# Altium project stimu.PrjPcb
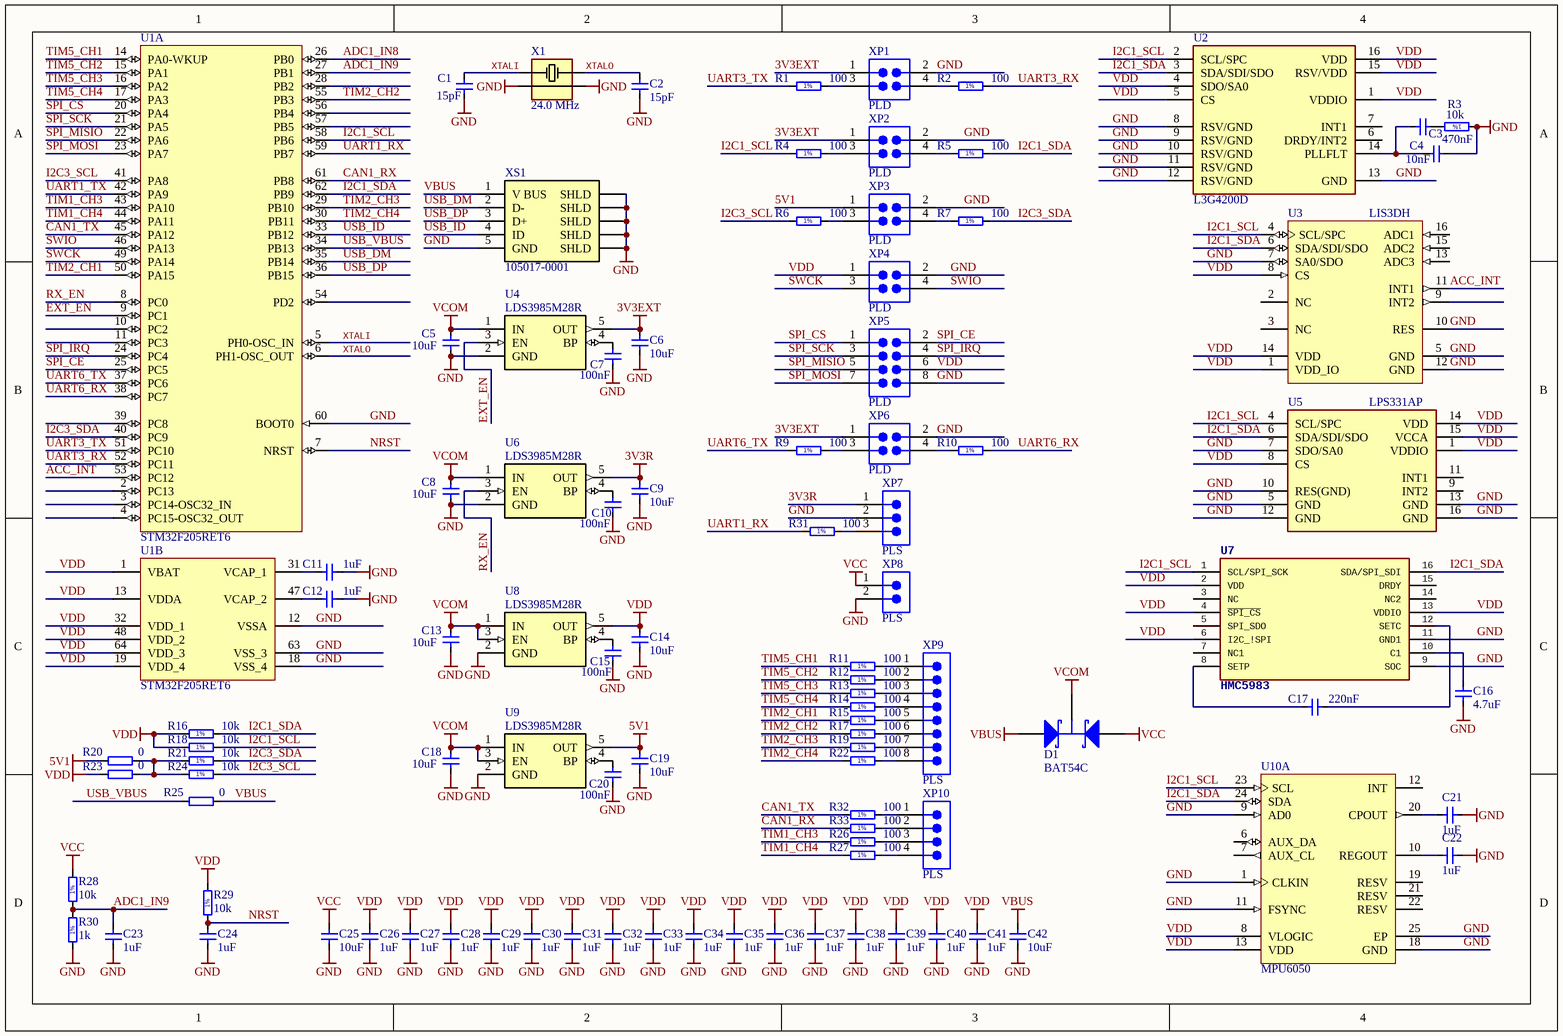
[diagram p0: stimu.SchDoc]
1 sheet, 98 parts. Net scope: global (net labels, ports and power ports of the same name join across sheets).
Board file: stimu.PcbDoc

## Sheet stimu.SchDoc
size A4

### Parts
(Parts that share a designator on the sheet are numbered #1, #2 ... from top to bottom, then left to right.)
C1  15pF  [CAP0402R]
C2  15pF  [CAP0402R]
C3  470nF  [CAP0402R]
C4  10nF  [CAP0402R]
C5  10uF  [CAP0603R]
C6  10uF  [CAP0603R]
C7  100nF  [CAP0402R]
C8  10uF  [CAP0603R]
C9  10uF  [CAP0603R]
C10  100nF  [CAP0402R]
C11  1uF  [CAP0402R]
C12  1uF  [CAP0402R]
C13  10uF  [CAP0603R]
C14  10uF  [CAP0603R]
C15  100nF  [CAP0402R]
C16  4.7uF  [CAP0402R]
C17  220nF  [CAP0402R]
C18  10uF  [CAP0603R]
C19  10uF  [CAP0603R]
C20  100nF  [CAP0402R]
C21  1uF  [CAP0402R]
C22  1uF  [CAP0402R]
C23  1uF  [CAP0402R]
C24  1uF  [CAP0402R]
C25  10uF  [CAP0805R]
C26  1uF  [CAP0402R]
C27  1uF  [CAP0402R]
C28  1uF  [CAP0402R]
C29  1uF  [CAP0402R]
C30  1uF  [CAP0402R]
C31  1uF  [CAP0402R]
C32  1uF  [CAP0402R]
C33  1uF  [CAP0402R]
C34  1uF  [CAP0402R]
C35  1uF  [CAP0402R]
C36  1uF  [CAP0402R]
C37  1uF  [CAP0402R]
C38  1uF  [CAP0402R]
C39  1uF  [CAP0402R]
C40  1uF  [CAP0402R]
C41  1uF  [CAP0402R]
C42  10uF  [CAP0603R]
D1  BAT54C  [NXP-SOT23-3_V]
R1  100  [RES0402R]
R2  100  [RES0402R]
R3  10k  [RES0402R]
R4  100  [RES0402R]
R5  100  [RES0402R]
R6  100  [RES0402R]
R7  100  [RES0402R]
R9  100  [RES0402R]
R10  100  [RES0402R]
R11  100  [RES0402R]
R12  100  [RES0402R]
R13  100  [RES0402R]
R14  100  [RES0402R]
R15  100  [RES0402R]
R16  10k  [RES0402R]
R17  100  [RES0402R]
R18  10k  [RES0402R]
R19  100  [RES0402R]
R20  0  [RES0402R]
R21  10k  [RES0402R]
R22  100  [RES0402R]
R23  0  [RES0402R]
R24  10k  [RES0402R]
R25  0  [RES0402R]
R26  100  [RES0402R]
R27  100  [RES0402R]
R28  10k  [RES0402R]
R29  10k  [RES0402R]
R30  1k  [RES0402R]
R31  100  [RES0402R]
R32  100  [RES0402R]
R33  100  [RES0402R]
U1#1  STM32F205RET6  [LQFP64_L]  (part A of 2)
U1#2  STM32F205RET6  [LQFP64_L]  (part B of 2)
U2  L3G4200D  [LGA16-4X4X1.1_L]
U3  LIS3DH  [STM-LGA-16_N]
U4  LDS3985M28R  [SOT23H15-5]
U5  LPS331AP  [HCLGA-16L]
U6  LDS3985M28R  [SOT23H15-5]
U7  HMC5983  [HMC5983]
U8  LDS3985M28R  [SOT23H15-5]
U9  LDS3985M28R  [SOT23H15-5]
U10  MPU6050  [INSE-QFN-24_V]  (part A of 2)
X1  24.0 MHz  [3225]
XP1  PLD  [PLD-04]
XP2  PLD  [PLD-04]
XP3  PLD  [PLD-04]
XP4  PLD  [PLD-04]
XP5  PLD  [PLD-08]
XP6  PLD  [PLD-04]
XP7  PLS  [PLS-03]
XP8  PLS  [PLS-02]
XP9  PLS  [PLS-08]
XP10  PLS  [PLS-04]
XS1  105017-0001  [105017-0001]

### Nets
3V3EXT: C6.2 U4.5(OUT) XP1.1 XP2.1 XP6.1
3V3R: C9.2 U6.5(OUT) XP7.1
5V1: C19.2 R20.1 U9.5(OUT) XP3.1
GND: C1.2 C2.2 C4.1 C5.1 C6.1 C7.2 C8.1 C9.1 C10.2 C11.1 C12.1 C13.1 C14.1 C15.2 C16.2 C18.1 C19.1 C20.2 C21.2 C22.2 C23.1 C24.1 C25.1 C26.2 C27.2 C28.2 C29.2 C30.2 C31.2 C32.2 C33.2 C34.2 C35.2 C36.2 C37.2 C38.2 C39.2 C40.2 C41.2 C42.1 R3.1 R30.1 U1#1.60(BOOT0) U1#2.12(VSSA) U1#2.18(VSS_4) U1#2.63(VSS_3) U2.8(RSV/GND) U2.9(RSV/GND) U2.10(RSV/GND) U2.11(RSV/GND) U2.12(RSV/GND) U2.13(GND) U3.5(GND) U3.7(SA0/SDO) U3.10(RES) U3.12(GND) U4.2(GND) U5.5(GND) U5.7(SDO/SA0) U5.10(RES(GND)) U5.12(GND) U5.13(GND) U5.16(GND) U6.2(GND) U7.9(SOC) U7.11(GND1) U8.2(GND) U9.2(GND) U10.1(CLKIN) U10.9(AD0) U10.11(FSYNC) U10.18(GND) U10.25(EP) X1.2 X1.4 XP1.2 XP2.2 XP3.2 XP4.2 XP5.8 XP6.2 XP7.2 XP8.2 XS1.5(GND) XS1.SHLD
VBUS: C42.2 D1.1(A) R25.2 XS1.1(V_BUS)
VCC: C25.2 D1.2(A) R28.2 XP8.1
VCOM: C5.2 C8.2 C13.2 C18.2 D1.3(K) U4.1(IN) U6.1(IN) U8.1(IN) U8.3(EN) U9.1(IN) U9.3(EN)
VDD: C14.2 C26.1 C27.1 C28.1 C29.1 C30.1 C31.1 C32.1 C33.1 C34.1 C35.1 C36.1 C37.1 C38.1 C39.1 C40.1 C41.1 R16.1 R18.1 R23.1 R29.2 U1#2.1(VBAT) U1#2.13(VDDA) U1#2.19(VDD_4) U1#2.32(VDD_1) U1#2.48(VDD_2) U1#2.64(VDD_3) U2.1(VDDIO) U2.4(SDO/SA0) U2.5(CS) U2.15(RSV/VDD) U2.16(VDD) U3.1(VDD_IO) U3.8(CS) U3.14(VDD) U5.1(VDDIO) U5.8(CS) U5.14(VDD) U5.15(VCCA) U7.2(VDD) U7.4(~{SPI_CS}) U7.6(I2C_!SPI) U7.13(VDDIO) U8.5(OUT) U10.8(VLOGIC) U10.13(VDD) XP4.1 XP5.6
ACC_INT: U1#1.53(PC12) U3.11(INT1)
ADC1_IN8: U1#1.26(PB0)
ADC1_IN9: C23.2 R28.1 R30.2 U1#1.27(PB1)
CAN1_RX: R33.1 U1#1.61(PB8)
CAN1_TX: R32.1 U1#1.45(PA12)
EXT_EN: U1#1.9(PC1) U4.3(EN)
I2C1_SCL: R4.1 R18.2 U1#1.58(PB6) U2.2(SCL/SPC) U3.4(SCL/SPC) U5.4(SCL/SPC) U7.1(SCL/SPI_SCK) U10.23(SCL)
I2C1_SDA: R5.2 R16.2 U1#1.62(PB9) U2.3(SDA/SDI/SDO) U3.6(SDA/SDI/SDO) U5.6(SDA/SDI/SDO) U7.16(SDA/SPI_SDI) U10.24(SDA)
I2C3_SCL: R6.1 R24.2 U1#1.41(PA8)
I2C3_SDA: R7.2 R21.2 U1#1.40(PC9)
NRST: C24.2 R29.1 U1#1.7(NRST)
RX_EN: U1#1.8(PC0) U6.3(EN)
SPI_CE: U1#1.25(PC5) XP5.2
SPI_CS: U1#1.20(PA4) XP5.1
SPI_IRQ: U1#1.24(PC4) XP5.4
SPI_MISIO: U1#1.22(PA6) XP5.5
SPI_MOSI: U1#1.23(PA7) XP5.7
SPI_SCK: U1#1.21(PA5) XP5.3
SWCK: U1#1.49(PA14) XP4.3
SWIO: U1#1.46(PA13) XP4.4
TIM1_CH3: R26.1 U1#1.43(PA10)
TIM1_CH4: R27.1 U1#1.44(PA11)
TIM2_CH1: R15.1 U1#1.50(PA15)
TIM2_CH2: R17.1 U1#1.55(PB3)
TIM2_CH3: R19.1 U1#1.29(PB10)
TIM2_CH4: R22.1 U1#1.30(PB11)
TIM5_CH1: R11.1 U1#1.14(PA0-WKUP)
TIM5_CH2: R12.1 U1#1.15(PA1)
TIM5_CH3: R13.1 U1#1.16(PA2)
TIM5_CH4: R14.1 U1#1.17(PA3)
UART1_RX: R31.1 U1#1.59(PB7)
UART1_TX: U1#1.42(PA9)
UART3_RX: R2.2 U1#1.52(PC11)
UART3_TX: R1.1 U1#1.51(PC10)
UART6_RX: R10.2 U1#1.38(PC7)
UART6_TX: R9.1 U1#1.37(PC6)
USB_DM: U1#1.35(PB14) XS1.2(D-)
USB_DP: U1#1.36(PB15) XS1.3(D+)
USB_ID: U1#1.33(PB12) XS1.4(ID)
USB_VBUS: R25.1 U1#1.34(PB13)
XTALI: C1.1 U1#1.5(PH0-OSC_IN) X1.1
XTALO: C2.1 U1#1.6(PH1-OSC_OUT) X1.3
NetC3_1: C3.1 R3.2
NetC3_2: C3.2 C4.2 U2.14(PLLFLT)
NetC7_1: C7.1 U4.4(BP)
NetC10_1: C10.1 U6.4(BP)
NetC11_2: C11.2 U1#2.31(VCAP_1)
NetC12_2: C12.2 U1#2.47(VCAP_2)
NetC15_1: C15.1 U8.4(BP)
NetC16_1: C16.1 U7.10(C1)
NetC17_1: C17.1 U7.12(SETC)
NetC17_2: C17.2 U7.8(SETP)
NetC20_1: C20.1 U9.4(BP)
NetC21_1: C21.1 U10.20(CPOUT)
NetC22_1: C22.1 U10.10(REGOUT)
NetR1_2: R1.2 XP1.3
NetR2_1: R2.1 XP1.4
NetR4_2: R4.2 XP2.3
NetR5_1: R5.1 XP2.4
NetR6_2: R6.2 XP3.3
NetR7_1: R7.1 XP3.4
NetR9_2: R9.2 XP6.3
NetR10_1: R10.1 XP6.4
NetR11_2: R11.2 XP9.1
NetR12_2: R12.2 XP9.2
NetR13_2: R13.2 XP9.3
NetR14_2: R14.2 XP9.4
NetR15_2: R15.2 XP9.5
NetR17_2: R17.2 XP9.6
NetR19_2: R19.2 XP9.7
NetR20_2: R20.2 R21.1 R23.2 R24.1
NetR22_2: R22.2 XP9.8
NetR26_2: R26.2 XP10.3
NetR27_2: R27.2 XP10.4
NetR31_2: R31.2 XP7.3
NetR32_2: R32.2 XP10.1
NetR33_2: R33.2 XP10.2

Not connected (* = marked no-connect by the designer): U1#1 2(PC13) 3(PC14-OSC32_IN) 4(PC15-OSC32_OUT) 10(PC2) 11(PC3) 28(PB2) 39(PC8) 54(PD2) 56(PB4) 57(PB5); U2 6(DRDY/INT2) 7(INT1); U3 2(NC) 3(NC) 9(INT2) 13(ADC3) 15(ADC2) 16(ADC1); U5 9(INT2) 11(INT1); U7 3(NC) 5(SPI_SDO) 7(NC1) 14(NC2) 15(DRDY); U10 6(AUX_DA) 7(AUX_CL) 12(INT) 19(RESV) 21(RESV) 22(RESV)

### Notes on the sheet
- (in symbol R0402_1K_1%_0.0625W_100PPM) 1%
- (in symbol R0402_10K_1%_0.0625W_100PPM) 1%
- (in symbol R0402_100R_1%_0.0625W_100PPM) 1%

### Library data of the parts
C1 C2 = CC0402_15PF_50V_5%_NP0: Part Description: SMD Multilayer Chip Ceramic Capacitor; Manufacturer: GENERIC; Manufacturer1 Part Number: 223886915159; Voltage: 50V; TC: NP0; Tolerance: ±5%; Table: Capacitors SMD; Part Number: CC0402_15PF_50V_5%_NP0; Component Kind: Standard; Component Type: Standard; Pin Count: 2; Value: 15pF; Status: Not Recommended; Manufacturer Part Number: CC0402_15PF_50V_5%_NP0; Case: 0402; Mounted: Yes; Socket: No; SMD: Yes; Manufacturer1 Example: PHYCOMP; Manufacturer1 ComponentHeight: 0.55mm; HelpURL: \\cern.ch\dfs\Applications\Altium\Datasheets\CC0402_NP0_PHYCOMP.pdf; Author: I. Kuznetsov; CreateDate: 03.12.2007; LatestRevisionDate: 03.12.2007; Manufacturer Part Number 2: CC0402JPNPO9BN150
C3 = CC0402_470NF_6.3V_10%_X5R: Part Description: SMD Multilayer Chip Ceramic Capacitor; Manufacturer: GENERIC; Manufacturer1 Part Number: GRM155R60J474KE19D; Voltage: 6.3V; TC: X5R; Tolerance: ±10%; Table: Capacitors SMD; Part Number: CC0402_470NF_6.3V_10%_X5R; Component Kind: Standard; Component Type: Standard; Pin Count: 2; Value: 470nF; Status: Preferred; Manufacturer Part Number: CC0402_470NF_6.3V_10%_X5R; Case: 0402; Mounted: Yes; Socket: No; SMD: Yes; Manufacturer1 Example: MURATA; Manufacturer1 ComponentHeight: 0.55mm; HelpURL: \\cern.ch\dfs\Applications\Altium\Datasheets\CC0402_X5R_MURATA_GRM.pdf; Author: I. Kuznetsov; CreateDate: 22.04.2010; LatestRevisionDate: 22.04.2010
C4 = CC0402_10NF_25V_10%_X7R: Part Description: SMD Multilayer Chip Ceramic Capacitor; Manufacturer: GENERIC; Manufacturer1 Part Number: C1005X7R1E103KT; Voltage: 25V; TC: X7R; Tolerance: ±10%; Table: Capacitors SMD; Part Number: CC0402_10NF_25V_10%_X7R; Component Kind: Standard; Component Type: Standard; Pin Count: 2; Value: 10nF; Status: Preferred; Manufacturer Part Number: CC0402_10NF_25V_10%_X7R; Case: 0402; Mounted: Yes; Socket: No; SMD: Yes; Manufacturer1 Example: TDK; Manufacturer1 ComponentHeight: 0.55mm; HelpURL: \\cern.ch\dfs\Applications\Altium\Datasheets\CC0402_X7R_TDK_C.pdf; Author: I. Kuznetsov; CreateDate: 25.10.2012; LatestRevisionDate: 25.10.2012
C5 C6 C8 C9 C13 C14 C18 C19 C42 = CC0603_10UF_6.3V_20%_X5R: Part Description: SMD Multilayer Chip Ceramic Capacitor; Manufacturer: GENERIC; Manufacturer1 Part Number: C0603C106M9PAC; Voltage: 6.3V; TC: X5R; Tolerance: ±20%; Table: Capacitors SMD; Part Number: CC0603_10UF_6.3V_20%_X5R; Component Kind: Standard; Component Type: Standard; Pin Count: 2; Value: 10uF; Status: Preferred; Manufacturer Part Number: CC0603_10uF_6.3V_20%_X5R; Case: 0603; Mounted: Yes; Socket: No; SMD: Yes; Manufacturer1 Example: KEMET; Manufacturer1 ComponentHeight: 0.95mm; HelpURL: \\cern.ch\dfs\Applications\Altium\Datasheets\CC0603_X5R_KEMET.pdf; Author: I. Kuznetsov; CreateDate: 03.12.2007; LatestRevisionDate: 03.12.2007
C7 C10 C15 C20 = CC0402_100NF_16V_10%_X5R: Part Description: SMD Multilayer Chip Ceramic Capacitor; Manufacturer: GENERIC; Manufacturer1 Part Number: GRM155R61C104KA88D; Voltage: 16V; TC: X5R; Tolerance: ±10%; Table: Capacitors SMD; Part Number: CC0402_100NF_16V_10%_X5R; Component Kind: Standard; Component Type: Standard; Pin Count: 2; Value: 100nF; Status: None; Manufacturer Part Number: CC0402_100NF_16V_10%_X5R; Case: 0402; Mounted: Yes; Socket: No; SMD: Yes; Manufacturer1 Example: MURATA; Manufacturer1 ComponentHeight: 0.55mm; HelpURL: \\cern.ch\dfs\Applications\Altium\Datasheets\CC0402_X5R_MURATA_GRM.pdf; Author: I. Kuznetsov; CreateDate: 10.12.2013; LatestRevisionDate: 10.12.2013; Manufacturer Part Number 2: CC0402KPX5R7BB104
C11 C12 C21-C24 C26-C41 = CC0402_1UF_16V_10%_X5R: Part Description: SMD Multilayer Chip Ceramic Capacitor; Manufacturer: GENERIC; Manufacturer1 Part Number: C1005X5R1C105KT; Voltage: 16V; TC: X5R; Tolerance: ±10%; Table: Capacitors SMD; Part Number: CC0402_1UF_16V_10%_X5R; Component Kind: Standard; Component Type: Standard; Pin Count: 2; Value: 1uF; Status: Preferred; Manufacturer Part Number: CC0402_1UF_16V_10%_X5R; Case: 0402; Mounted: Yes; Socket: No; SMD: Yes; Manufacturer1 Example: TDK; Manufacturer1 ComponentHeight: 0.55mm; HelpURL: \\cern.ch\dfs\Applications\Altium\Datasheets\CC0402_X5R_TDK_C.pdf; Author: I. Kuznetsov; CreateDate: 25.10.2012; LatestRevisionDate: 25.10.2012
C16 = CC0402_4.7UF_4V_20%_X5R: Part Description: SMD Multilayer Chip Ceramic Capacitor; Manufacturer: GENERIC; Manufacturer1 Part Number: C0402C475M7PAC; Voltage: 4V; TC: X5R; Tolerance: ±20%; Table: Capacitors SMD; Part Number: CC0402_4.7UF_4V_20%_X5R; Component Kind: Standard; Component Type: Standard; Pin Count: 2; Value: 4.7uF; Status: Preferred; Manufacturer Part Number: CC0402_4.7UF_4V_20%_X5R; Case: 0402; Mounted: Yes; Socket: No; SMD: Yes; Manufacturer1 Example: KEMET; Manufacturer1 ComponentHeight: 0.55mm; HelpURL: \\cern.ch\dfs\Applications\Altium\Datasheets\CC0402_X5R_KEMET.pdf; Author: I. Kuznetsov; CreateDate: 08.06.2010; LatestRevisionDate: 08.06.2010; Manufacturer Part Number 2: CC0402MRX5R4BB475
C17 = CC0402_220NF_16V_10%_X7R: Part Description: SMD Multilayer Chip Ceramic Capacitor; Manufacturer: GENERIC; Manufacturer1 Part Number: C1005X7R1C224KT; Voltage: 16V; TC: X7R; Tolerance: ±10%; Table: Capacitors SMD; Part Number: CC0402_220NF_16V_10%_X7R; Component Kind: Standard; Component Type: Standard; Pin Count: 2; Value: 220nF; Status: Preferred; Manufacturer Part Number: CC0402_220NF_16V_10%_X7R; Case: 0402; Mounted: Yes; Socket: No; SMD: Yes; Manufacturer1 Example: TDK; Manufacturer1 ComponentHeight: 0.55mm; HelpURL: \\cern.ch\dfs\Applications\Altium\Datasheets\CC0402_X7R_TDK_C.pdf; Author: I. Kuznetsov; CreateDate: 25.10.2012; LatestRevisionDate: 25.10.2012; Manufacturer Part Number 2: CC0402KRX7R7BB224
C25 = CC0805_10UF_10V_10%_X7R: Part Description: SMD Multilayer Chip Ceramic Capacitor; Manufacturer: GENERIC; Manufacturer1 Part Number: GRM21BR71A106KE51L; Voltage: 10V; TC: X7R; Tolerance: ±10%; Table: Capacitors SMD; Part Number: CC0805_10UF_10V_10%_X7R; Component Kind: Standard; Component Type: Standard; Pin Count: 2; Value: 10uF; Status: Preferred; Manufacturer Part Number: CC0805_10UF_10V_10%_X7R; Case: 0805; Mounted: Yes; Socket: No; SMD: Yes; Manufacturer1 Example: MURATA; Manufacturer1 ComponentHeight: 1.35mm; HelpURL: \\cern.ch\dfs\Applications\Altium\Datasheets\CC0805_X7R_MURATA.pdf; Author: I. Kuznetsov; CreateDate: 30.04.2012; LatestRevisionDate: 30.04.2012; Manufacturer Part Number 2: CC0805KKX7R6BB106
D1 = CMP-0417-00003-1: Schottky Barrier Diode, 30 V, 2 uA, -55 to 150 degC, 3-Pin SOT23, RoHS, Tape and Reel; Manufacturer: NXP Semiconductors; IR (uA): 2; VF (mV): 800; Trr (ns): 5; Cd (pF): 10; VR (V): 30; Rth(j-a) (K/W): 500; RoHS: TRUE; Packing: Tape and Reel; ComponentLink2URL: http://www.nxp.com/documents/data_sheet/BAT54_SER.pdf; PartNumber: BAT54C; ComponentLink2Description: Datasheet; Temperature Range: -55 to 150 degC; PackageReference: SOT23-3; PackageDescription: 3-Pin Plastic Surface-mounted Package, Body 1.3 x 2.9 mm, Pitch 0.95 mm; Mounting Technology: Surface Mount; ComponentLink1URL: http://www.nxp.com/; DatasheetVersion: Rev. 5; ComponentLink1Description: Manufacturer URL
R1 R2 R4-R7 R9-R15 R17 R19 R22 R26 R27 R31-R33 = R0402_100R_1%_0.0625W_100PPM: Part Description: General Purpose Thick Film Chip Resistor; Manufacturer: GENERIC; Manufacturer1 Part Number: 232270671001L; TC: ±100ppm/°C; Tolerance: ±1%; Table: Resistors SMD; Part Number: R0402_100R_1%_0.0625W_100PPM; Component Kind: Standard; Component Type: Standard; Footprint: RESC1005X40N; Pin Count: 2; Value: 100; Status: Not recommended; Power: 0.0625W; Manufacturer Part Number: R0402_100R_1%_0.0625W_100PPM; Case: 0402; Mounted: Yes; Socket: No; SMD: Yes; Manufacturer1 Example: YAGEO PHYCOMP; Manufacturer1 ComponentHeight: 0.4mm; HelpURL: \\cern.ch\dfs\Applications\Altium\Datasheets\R0402_Phycomp_RC0402.pdf; Author: CERN DEM JLC; CreateDate: 03.12.2007; LatestRevisionDate: 17.10.2012
R3 R16 R18 R21 R24 R28 R29 = R0402_10K_1%_0.0625W_100PPM: Part Description: General Purpose Thick Film Chip Resistor; Manufacturer: GENERIC; Manufacturer1 Part Number: 232270671003L; TC: ±100ppm/°C; Tolerance: ±1%; Table: Resistors SMD; Part Number: R0402_10K_1%_0.0625W_100PPM; Component Kind: Standard; Component Type: Standard; Footprint: RESC1005X40N; Pin Count: 2; Value: 10k; Status: Not recommended; Power: 0.0625W; Manufacturer Part Number: R0402_10K_1%_0.0625W_100PPM; Case: 0402; Mounted: Yes; Socket: No; SMD: Yes; Manufacturer1 Example: YAGEO PHYCOMP; Manufacturer1 ComponentHeight: 0.4mm; HelpURL: \\cern.ch\dfs\Applications\Altium\Datasheets\R0402_Phycomp_RC0402.pdf; Author: CERN DEM JLC; CreateDate: 03.12.2007; LatestRevisionDate: 17.10.2012
R20 R23 R25 = R0402_0R_JUMPER: Part Description: 1A (0.05R Max DC Resistance) Zero Ohm Jumper; Manufacturer: GENERIC; Manufacturer1 Part Number: 232270591001L; Table: Resistors SMD; Part Number: R0402_0R_JUMPER; Component Kind: Standard; Component Type: Standard; Footprint: RESC1005X40N; Pin Count: 2; Value: 0; Status: Not recommended; Manufacturer Part Number: R0402_0R_JUMPER; Case: 0402; Mounted: Yes; Socket: No; SMD: Yes; Manufacturer1 Example: YAGEO PHYCOMP; Manufacturer1 ComponentHeight: 0.4mm; HelpURL: \\cern.ch\dfs\Applications\Altium\Datasheets\R0402_Phycomp_RC0402.pdf; Author: CERN DEM JLC; CreateDate: 03.12.2007; LatestRevisionDate: 17.10.2012
R30 = R0402_1K_1%_0.0625W_100PPM: Part Description: General Purpose Thick Film Chip Resistor; Manufacturer: GENERIC; Manufacturer1 Part Number: 232270671002L; TC: ±100ppm/°C; Tolerance: ±1%; Table: Resistors SMD; Part Number: R0402_1K_1%_0.0625W_100PPM; Component Kind: Standard; Component Type: Standard; Footprint: RESC1005X40N; Pin Count: 2; Value: 1k; Status: Not recommended; Power: 0.0625W; Manufacturer Part Number: R0402_1K_1%_0.0625W_100PPM; Case: 0402; Mounted: Yes; Socket: No; SMD: Yes; Manufacturer1 Example: YAGEO PHYCOMP; Manufacturer1 ComponentHeight: 0.4mm; HelpURL: \\cern.ch\dfs\Applications\Altium\Datasheets\R0402_Phycomp_RC0402.pdf; Author: CERN DEM JLC; CreateDate: 03.12.2007; LatestRevisionDate: 17.10.2012
U1#1 U1#2 = CMP-0237-00099-1: STM32 ARM-based 32-bit MCU Connectivity Line with 512 kB Flash, 128 kB Internal RAM, -40 to +85°C Temperature, 64-Pin LQFP, Tray; ComponentLink2URL: www.st.com/stm32; PackageVersion: rev13, Apr-2011; PackageReference: LQFP64; ComponentLink3URL: http://www.st.com/internet/com/home/home.jsp; PackageDescription: 64-Pin Low-Profile Quad Flat Pack, 10 x 10 mm Body, 0.5 mm Pitch (LQFP64); ComponentLink2Description: STM32 Family Web Page; ComponentLink1Description: STM32F205/207 Datasheet; DatasheetVersion: rev6.0, Apr-2011; ComponentLink3Description: st.com Home; ComponentLink1URL: http://www.st.com/internet/com/TECHNICAL_RESOURCES/TECHNICAL_LITERATURE/DATASHEET/CD00237391.pdf
U2 = L3G4200D: Table: Analog and Interface; Part Number: L3G4200D; Device: L3G4200D
U3 = CMP-0234-00056-3: MEMS Digital Output Motion Sensor Ultra Low-Power High Performance 3-Axes "nano" Accelerometer, 1.71 to 3.6 V, -40 to 85 degC, 16-pin (LGA-16), Pb-Free, Tray; Manufacturer: STMicroelectronics; Interface: I2C, SPI; Current Consumption in Power-Down mode: 0.5 uA; Bandwidth: 5 kHz; ComponentLink1URL: http://www.st.com/; Packing: Tray; ComponentLink1Description: Manufacturer URL; Wide Supply Voltage: 1.71 to 3.6 V; ComponentLink3Description: Package Specification; ComponentLink3URL: http://www.st.com/st-web-ui/static/active/en/resource/technical/document/datasheet/CD00274221.pdf; PackageDescription: 16-Pin Land Grid Array, Body 3 x 3 mm, Pitch 0.5 mm; Output Type: Digital; PartNumber: LIS3DH; RoHS: TRUE; DatasheetVersion: Rev. 1; PackageReference: LGA-16; Mounting Technology: Surface Mount; ComponentLink2URL: http://www.st.com/st-web-ui/static/active/en/resource/technical/document/datasheet/CD00274221.pdf; Operating Temperature: -40 to 85 degC; ComponentLink2Description: Datasheet
U4 U6 U8 U9 = C014S0053T0000000090L0000000090: ManufName: ST Microelectronics; SubClassName: аналоговая; ValueBOM: Микросхема LDS3985M28R ST Microelectronics; ValueSch: LDS3985M28R; Design Item ID: C014S0053T0000000090L0000000090; Type: DA?; ClassName: Микросхема; PartNumber: LDS3985M28R; TypeName: LDS3985M28R; PackageName: SOT-23-5L
U5 = LPS331AP: Table: Analog and Interface; Part Number: LPS331AP; Device: LPS331AP
U7 = C014S0053T0000000112L0000000112: ManufName: Honywell; SubClassName: смешанного типа сигналов; ValueBOM: Микросхема HMC5983 Honywell; Design Item ID: C014S0053T0000000112L0000000112; Type: DA?; ValueSCH: HMC5983; ClassName: Микросхема; PartNumber: HMC5983; TypeName: HMC5983; PackageName: HMC5983
U10 = CMP-1753-00002-1: 3-Axis Gyroscope, 3-Axis Accelerometer / , 2.375 to 3.46 V, -40 to 105 degC, 24-Pin QFN, RoHS, Tape and Reel; Resistance: 5.6 kohm; Tolerance: 1%; Voltage Rating: 75 V; Power Rating: 100 mW; ComponentLink1Description: Manufacturer URL; Mount: Surface Mount; Max Operating Temperature: 155degC; Package Quantity: 5000; ComponentLink2Description: Datasheet; Pins: 2; Packaging: Tape and Reel; Case Code (Imperial): 0603; PackageReference: QFN-24; ComponentLink2URL: https://datasheet.ciiva.com/1513/1788002-1513632.pdf; Radiation Hardening: No; ComponentLink1URL: http://www.invensense.com/; PackageDescription: 24-Pin Quad Flat No-lead Package, Body 4 x 4 mm, Pitch 0.5 mm; Height: 0.45 mm; Case/Package: 0603; Case Code (Metric): 1608; REACH SVHC: Yes; Min Operating Temperature: -55degC; DatasheetVersion: Rev. 3.4, 08/2013; Width: 0.8 mm; RoHSCompliant: True; Length: 1.6 mm
X1 = C012S0075T0000000004L0000000004: http://geyer-electronic.de/uploads/tx_userartikelfrequenz/GEYER-KX-7_01.pdf; PartNumber: KX-7; ManufName: GEYER; Value: 24M; SubClassName: Кварцевый генератор; Design Item ID: C012S0075T0000000004L0000000004; Type: X?; ValueSCH: 24.0 MHz; ClassName: Пьезоэлектрические приборы; ValuePE: 24.0 MHz; ValueBOM: =SubClassName+' '+PartNumber+' ' +ValuePE+' '+V_Power_key+' '+ManufName
XP1-XP4 XP6 = PLD-04: Table: AUK; Part Number: PLD-04; Family: PLD; Device: PLD-04; ComponentLink1URL: http://lib.chipdip.ru/227/DOC000227157.pdf
XP5 = PLD-08: Table: AUK; Part Number: PLD-08; Family: PLD; Device: PLD-08; ComponentLink1URL: http://lib.chipdip.ru/227/DOC000227157.pdf
XP7 = PLS-03: Manufacturer: AUK; Part Number: PLS-03; Component Kind: Standard; Component Type: Standard; PackageDescription: PLS-03; Pin Count: 3; Family: PLS; SMD: Yes; Device: PLS-03; Manufacturer Part Number: PLS-03; ComponentLink1URL: http://lib.chipdip.ru/227/DOC000227157.pdf; Table: AUK
XP8 = PLS-02: Manufacturer: AUK; Part Number: PLS-02; Component Kind: Standard; Component Type: Standard; PackageDescription: PLS-02; Pin Count: 2; Family: PLS; SMD: No; Device: PLS-02; Manufacturer Part Number: PLS-02; ComponentLink1URL: http://lib.chipdip.ru/227/DOC000227157.pdf; Table: AUK
XP9 = PLS-08: Manufacturer: AUK; Part Number: PLS-08; Component Kind: Standard; Component Type: Standard; PackageDescription: PLS-08; Pin Count: 8; Family: PLS; SMD: Yes; Device: PLS-08; Manufacturer Part Number: PLS-08; ComponentLink1URL: http://lib.chipdip.ru/227/DOC000227157.pdf; Table: AUK
XP10 = PLS-04: Manufacturer: AUK; Part Number: PLS-04; Component Kind: Standard; Component Type: Standard; PackageDescription: PLS-04; Pin Count: 4; Family: PLS; SMD: No; Device: PLS-04; Manufacturer Part Number: PLS-04; ComponentLink1URL: http://lib.chipdip.ru/227/DOC000227157.pdf; Table: AUK
XS1 = C011S0070T0000000044L0000000044: ManufName: NONE; Marking: "XS?"; SubClassName: Розетка; NetQuantity: 5; ConnectTypeKey: F; VoltageMax: 250; ValueBOM: Розетка 105017-0001; Design Item ID: C011S0070T0000000044L0000000044; Type: XS?; ValueSCH: 105017-0001; ClassName: Соединители; PartNumber: 105017-0001; TypeName: 105017-0001; Current_pin_max: 5